# Altium schematic sheet Powering.SchDoc
size A; SheetNumber: 1; SheetTotal: 2
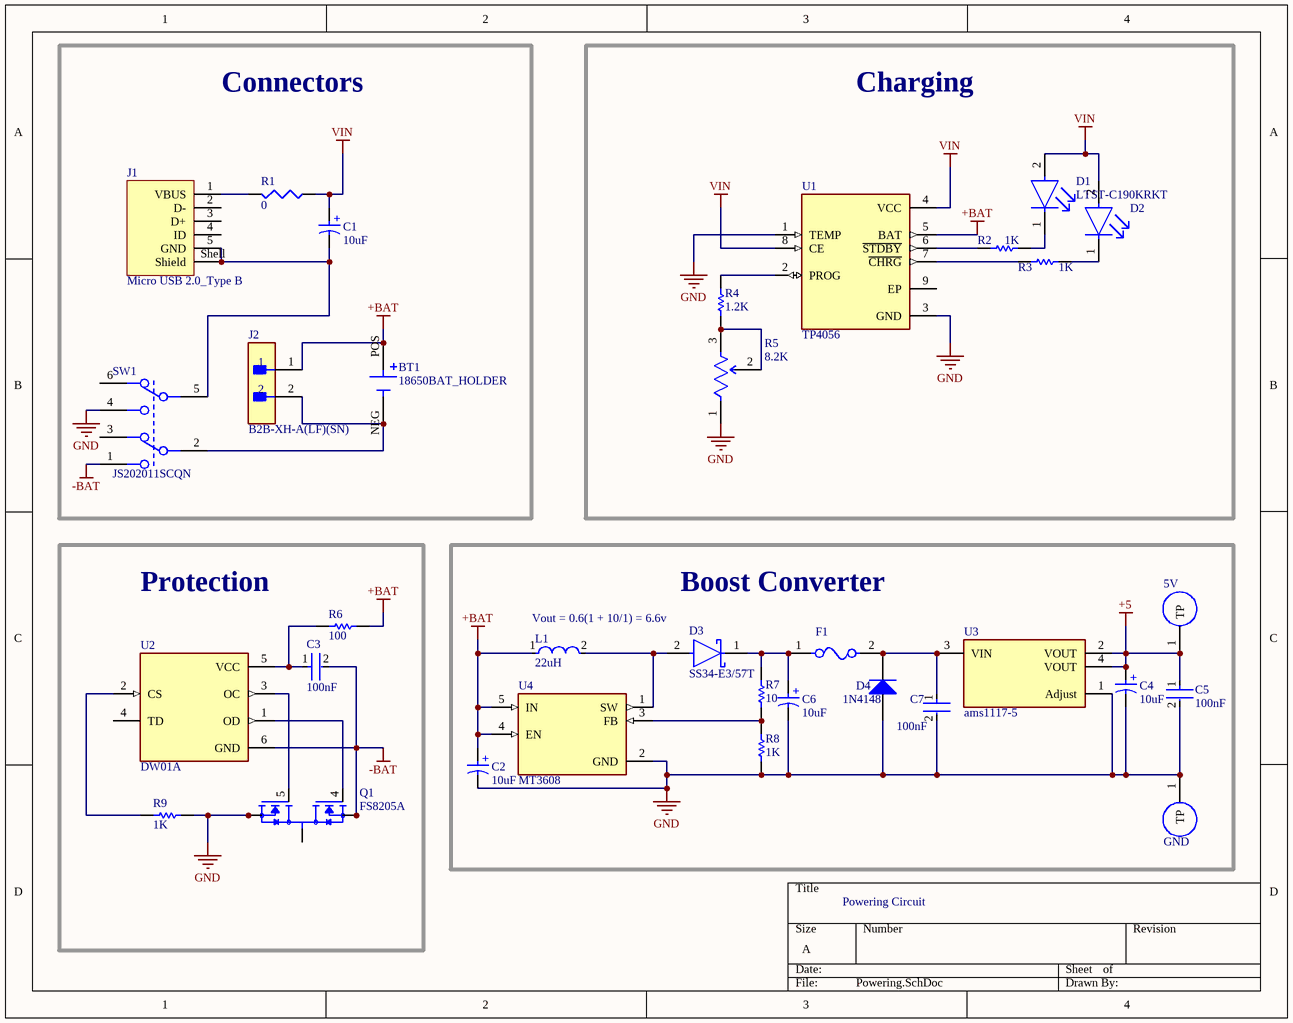
[diagram p0: Powering.SchDoc]

## Parts
5V  Test Point  [Test_Point]  (value not drawn)  (no BOM)
BT1  18650BAT_HOLDER  [18650BAT_HOLDER]
C1  10uF  [WCAP-ASLU_D3H5.5]
C2  10uF  [WCAP-ASLU_D3H5.5]
C3  100nF  [FP-C0402-BB-MFG]
C4  10uF  [WCAP-ASLU_D3H5.5]
C5  100nF  [FP-CGA3E-0_3-0_1-IPC_A]
C6  10uF  [WCAP-ASLU_D3H5.5]
C7  100nF  [FP-CGA3E-0_3-0_1-IPC_A]
D1  LTST-C190KRKT  [FP-LTST-C190KRKT-MFG]
D2  LTST-C190GKT  [FP-LTST-C190GKT-MFG]  (value not drawn)
D3  SS34-E3/57T  [FP-95402-MFG]
D4  1N4148  [DIOD-SOD123-2_V]
F1  0154004.DR  [FP-0154-MFG]  (value not drawn)
GND  Test Point  [Test_Point]  (value not drawn)  (no BOM)
J1  Micro USB 2.0_Type B  [Micro USB 2.0_Type B]
J2  B2B-XH-A(LF)(SN)  [FP-B2B-XH-A_LF_SN-MFG]
L1  22uH  [FP-IHLP-2525CZ-FP_2_413x3-MFG]
Q1  FS8205A  [SOP65P640X120-8N]
R1  value 0  [J1-0603]
R2  1K  [RESC1005X40X25NL05T10]
R3  1K  [RESC1005X40X25NL05T10]
R4  1.2K  [RESC1608X55X25ML10T15]
R5  8.2K  [FP-TS53YL-MFG]
R6  100  [RESC1005X40X25NL05T10]
R7  10  [RESC1608X55X25ML10T15]
R8  1K  [RESC1608X55X25ML10T15]
R9  1K  [RESC1608X55X25ML10T15]
SW1  JS202011SCQN  [FP-JS202011SCQN-MFG]
U1  TP4056  [TP4056]
U2  DW01A  [SOT95P280X145-6N]
U3  ams1117-5  [FP-ams1117-IPC_C]
U4  MT3608  [SOT95P280X145-6N]

## Blocks framed on the sheet
Connectors: BT1 C1 J1 J2 R1 SW1
Charging: D1 D2 R2-R5 U1
Protection: C3 Q1 R6 R9 U2
Boost Converter: 5V C2 C4-C7 D3 D4 F1 GND L1 R7 R8 U3 U4

## Nets
+5: 5V.1(TP) C4.1(P) C5.1 U3.2(VOUT) U3.4(VOUT)
+BAT: BT1.POS C2.1(P) J2.1 L1.1 R6.2 U1.5(BAT) U4.4(EN) U4.5(IN)
-BAT: C3.2 Q1.2(S1) Q1.3(S1) SW1.1 U2.6(GND)
GND: C2.2(N) C4.2(N) C5.2 C6.2(N) C7.2 D4.1(A) GND.1(TP) Q1.6(S2) Q1.7(S2) R5.1(a) R8.1 R9.2 SW1.4 U1.1(TEMP) U1.3(GND) U3.1(Adjust) U4.2(GND)
VIN: C1.1(P) D1.2(A) D2.2(A) R1.1 U1.4(VCC) U1.8(CE)
NetBT1_NEG: BT1.NEG J2.2 SW1.2
NetC1_2: C1.2(N) J1.5(GND) J1.Shell(Shield) SW1.5
NetC3_1: C3.1 R6.1 U2.5(VCC)
NetC6_1: C6.1(P) D3.1(C) F1.1 R7.2
NetC7_1: C7.1 D4.2(K) F1.2 U3.3(VIN)
NetD1_1: D1.1(C) R2.2
NetD2_1: D2.1(C) R3.2
NetD3_2: D3.2(A) L1.2 U4.1(SW)
NetJ1_1: J1.1(VBUS) R1.2
NetQ1_1: Q1.1(D12) Q1.8(D12)
NetQ1_4: Q1.4(G1) U2.1(OD)
NetQ1_5: Q1.5(G2) U2.3(OC)
NetR2_1: R2.1 U1.6(~{STDBY})
NetR3_1: R3.1 U1.7(~{CHRG})
NetR4_1: R4.1 R5.2(b) R5.3(c)
NetR4_2: R4.2 U1.2(PROG)
NetR7_1: R7.1 R8.2 U4.3(FB)
NetR9_1: R9.1 U2.2(CS)

Not connected (* = marked no-connect by the designer): J1 2(D-) 3(D+) 4(ID); SW1 3 6; U1 9(EP); U2 4(TD)

## Notes on the sheet
- Vout = 0.6(1 + 10/1) = 6.6v
- Powering Circuit
- (in symbol WCAP-ASLU_D3H5.5) +

## Library data of the parts
BT1 = 18650BAT_HOLDER: Battery Holder (Open) 18650 1 Cell PC Pin; MP: BK-18650-PC2; Price: None; Value: *; Package: None; Availability: Unavailable
C1 C2 C4 C6 = WCAP-ASLU_D3H5.5: WCAP-ASLU Aluminum Electrolytic Capacitor, V-Chip, D4 x H5.5mm, 10uF, 6.3V; Manufacturer Part Number: 865090140001; Manufacturer: Wurth Elektronik; Capacitance Tolerance: +/-20%; Dissipation Factor: 26%; Endurance: 1000h; Leakage Current: 0.4uA; Ripple Current: 15mA; Technical Reference: ASBB055100M6R3DVCTAA000; Category: Aluminum Electrolytic Capacitors; Match Code: WCAP-ASLU; ComponentLink1Description: Website Link; ComponentLink1URL: https://www.we-online.com/redexpert/article/865090140001?ad; ComponentLink2Description: Datasheet Link; ComponentLink2URL: https://www.we-online.com/redexpert/spec/865090140001?ad; Mount: Surface Mount; Operating Temperature Max: 85°C; Operating Temperature Min: -40°C; Packaging: Tape and Reel; Height: 5.5mm; Diameter: 4mm; Capacitance: 10uF; Rated Voltage (DC): 6.3V
C3 = CMP-2008-02046-2: CAP CER 0.1UF 10V X5R 0402; Manufacturer: Kemet; Manufacturer Part Number: C0402C104K8PACTU; Material: Ceramic; Capacitance: 0.10 μF; Temperature Coefficient: 15%; Tolerance: 0.1; Value: 0.10 μF; Package: C0402-BB; Temperature: -55°C to +125°C; ComponentLink2Description: Datasheet; Temperature Characteristic: X5R; Device Class L1: Passive Components; Height: 0.55mm; Lead Free: Yes; ComponentLink2URL: https://content.kemet.com/datasheets/KEM_C1002_X7R_SMD.pdf; Device Class L2: Capacitors; Temperature Range Low: -55°C; Temperature Range High: +125°C; RoHS: TRUE; Octopart: https://octopart.com/c0402c104k8pactu-kemet-140039; Automotive: No; Mouser Description: Capacitor 100 nF 10 VDC 0402; Category: Cap; Voltage Rating: 10 V; Digikey Description: CAP CER 0.1UF 10V X5R 0402; Ipc Land Pattern Name: CAPC10050X50; Device Class L3: Ceramic Capacitors
C5 C7 = CMP-2000-07546-2: Cap Ceramic 100nF 50V X7R 10% Pad SMD 0603 +125°C Automotive T/R; Weight: 7.1E-05oz; Composition: Ceramic; Max Operating Temperature: 125°C; Termination: SMD/SMT; Dielectric: X7R; Length: 1.6mm; Package Quantity: 1; REACH SVHC: No SVHC; Lead Free: Lead Free; Case Code (Metric): 1608; Min Operating Temperature: -55°C; Packaging: Tape and Reel; Tolerance: 10%; Voltage Rating: 50V; Case Code (Imperial): 0603; Capacitance: 100nF; Case/Package: 0603; Voltage Rating (DC): 50V; Depth: 0.8mm; Radiation Hardening: No; Ratings: AEC-Q200; Mount: Surface Mount; Voltage: 50V; Thickness: 0.035inch; Width: 0.8mm; Height: 0.8mm
D1 = CMP-1674-00011-2: LED RED CLEAR CHIP SMD; Reverse Voltage: 5V; Viewing Angle: 130°; Power Rating: 75mW; Test Current: 20mA; Number of Elements: 1; Lens Color: Colorless; Wavelength: 639nm; Dominant Wavelength: 631nm; Lens Style: Diffused; Forward Current: 30mA; Forward Voltage: 2.4V; Luminous Intensity: 54mcd; Color: Red; Case Code (Imperial): 0603; Lens Transparency: Clear; Lead Free: Lead Free; Package Quantity: 1; Packaging: Tape and Reel; Max Operating Temperature: 85°C; Number of Pins: 2; Height: 0.8mm; Case/Package: 0603; Number of LEDs: 1; Width: 0.8mm; Case Code (Metric): 1608; Depth: 0.8mm; Mount: Surface Mount; Radiation Hardening: No; Length: 1.6mm; Illumination Color: Red; Power Dissipation: 75mW; Min Operating Temperature: -55°C
D2 = CMP-22017-000005-2: LED GREEN CLEAR CHIP SMD; Dominant Wavelength: 569nm; Reverse Voltage: 5V; Lens Color: Colorless; Viewing Angle: 130°; Voltage: 2V; Forward Current: 30mA; Power Dissipation: 100mW; Luminous Intensity: 6mcd; Number of LEDs: 1; Forward Voltage: 2.1V; Wavelength: 565nm; Test Current: 10mA; Min Operating Temperature: -55°C; Lens Style: Clear; Mount: Surface Mount; Width: 0.8mm; Packaging: Tape and Reel; Lens Transparency: Clear; Case Code (Metric): 1608; Depth: 0.8mm; Case Code (Imperial): 0603; Case/Package: 0603; Number of Pins: 2; Max Operating Temperature: 85°C; Lead Free: Lead Free; Number of Elements: 1; Length: 1.6mm; Height: 0.8mm; Package Quantity: 1; Power Rating: 100mW; Radiation Hardening: No; Illumination Color: Green; Color: Green
D3 = CMP-02539-000012-1: DIODE SCHOTTKY 40V 3A DO214AB; Manufacturer: Vishay; Max Junction Temp: +150°C; Peak Reverse Current: 0.5mA; Max Surge Forward Current: 100A; Standoff Height: 0mm; ComponentLink2Description: Datasheet; Device Class L3: Schottky Diodes; Height: 2.62mm; Max Repetitive Reverse Voltage: 40V; Lead Free: Yes; Package: 95402; Temperature Range High: +150°C; ComponentLink2URL: http://www.vishay.com/docs/88751/ss32.pdf; Temperature: -55°C to +150°C; Footprint Url: http://www.vishay.com/docs/95402/smc.pdf; Automotive: No; Forward Current: 3A; Category: Diode; Manufacturer Part Number: SS34-E3/57T; RoHS: TRUE; Device Class L2: Diodes; Mouser Description: Schottky Diodes & Rectifiers 3.0 Amp 40 Volt; Octopart: https://octopart.com/ss34-e3%2F57t-vishay-39552907; Temperature Range Low: -55°C; Device Class L1: Discrete Semiconductors; Digikey Description: DIODE SCHOTTKY 40V 3A DO214AB
D4 = CMP-2000-04932-2: Fast Switching Diode, 100 V, 0.15 A, -65 to 150 degC, 2-Pin?SOD123, RoHS, Tape and Reel; Recovery Time: 4ns; Brand: DiodesIncorporated; Unit Weight: 0.000353oz; Max Surge Current: 2A; Peak Reverse Voltage: 100V; Ir - Reverse Current: 1uA; Vf - Forward Voltage: 1.25V; Configuration: Single; If - Forward Current: 0.15A; Product Category: Diodes-GeneralPurpose,Power,Switching; Operating Temperature Range: -65Cto+150C; Packaging: Reel; Manufacturer URL: http://www.diodes.com/; Maximum Operating Temperature: +150C; Height: 1.25mm; Minimum Operating Temperature: -65C; Product: SwitchingDiodes; Package URL: http://www.diodes.com/datasheets/ds18004.pdf; Type: SwitchingDiode; Package Reference: SOD123-2; Width: 1.7mm; Datasheet URL: http://www.farnell.com/datasheets/1915529.pdf; Datasheet Version: Rev. 24-2, 10/2013; Series: 1N4148; Factory Pack Quantity: 3000; Length: 2.85mm; RoHS: True; Manufacturer: DiodesIncorporated; Mounting Style: SMD/SMT; Package / Case: SOD-123
F1 = CMP-08605-000003-1: FUSE BRD MNT 4A 125VAC/VDC 2SMD; Manufacturer: Littelfuse; Fuse Blow Speed: Fast; Max Fuse Ac Voltage: 125V; Lead Free: Yes; Device Class L3: unset; Manufacturer Part Number: 0154004.DR; Device Class L2: Fuses; Package: 0154; ComponentLink2Description: Datasheet; Temperature Range Low: -55°C; Temperature Range High: +125°C; Device Class L1: Circuit Protection; Height: 3.81mm; Temperature: -55°C to +125°C; Mouser Description: Surface Mount Fuses Fuseblock w/ fuse 4A OMNI BLOK 154; Automotive: No; Digikey Description: FUSE BRD MNT 4A 125VAC/VDC 2SMD; RoHS: TRUE; Category: Fuse; Fuse Current: 4A; Max Fuse Dc Voltage: 125V; ComponentLink2URL: https://www.littelfuse.com/~/media/electronics/datasheets/fuses/littelfuse_fuse_154_154t_154l_154tl_datasheet.pdf.pdf; Octopart: https://octopart.com/0154004.dr-littelfuse-565861
J1 = Micro USB 2.0_Type B: NexarPartId: 52645113; Number of Contacts: 5; Contact Resistance: 30mΩ; Voltage Rating: 30V; Current Rating: 3A; USB Standard: USB 2.0; Gender: Receptacle; Insulation Resistance: 1GΩ; Height: 2.86mm; REACH SVHC: Unknown; Connector Type: USB; RoHS: Compliant; Features: Shielded; Termination: SMD/SMT; Number of Pins: 5; Contact Plating: Gold; Packaging: Tape and Reel; Contact Material: Gold; Mount: Horizontal, Surface Mount; Max Operating Temperature: 85°C; Lead Free: Lead Free; Min Operating Temperature: -40°C; Orientation: Horizontal; Operating Supply Voltage: 30V
J2 = CMP-2000-05888-3: CONN HEADER VERT 2POS 2.5MM; Current Rating: 3A; Voltage Rating: 250V; Number of Contacts: 2; Contact Resistance: 20mR; Wire/Cable Gauge: 22AWG; Insulation Resistance: 1GR; Connector Type: Male Pin; Packaging: Bulk; Contact Material: Brass; Lead Free: Lead Free; Orientation: Straight; Contact Plating: Tin; Max Current Rating: 3A; Termination: Solder; Fastening Type: Detent; Depth: 5.75mm; Housing Material: Polyamide; REACH SVHC: No SVHC; Series: XH; Voltage Rating (AC): 250V; Number of Positions: 2; Color: Natural; Contact Type: Male Pin; Max Voltage Rating (DC): 250V; Pitch: 2.5mm; Lead Pitch: 2.5mm; Mount: Through Hole; Max Operating Temperature: 85°C; Length: 7.4mm; Max Voltage Rating (AC): 250V; Min Operating Temperature: -25°C; Number of Rows: 1; Housing Color: White
L1 = CMP-2000-06442-2: Commercial Inductors, Low DCR Series 22uH 2.9A 135mΩ 20%; Self Resonant Frequency: 1MHz; Shielding: Shielded; Core Material: Ferrite; DC Resistance (DCR): 135mR; Test Frequency: 100kHz; Saturation Current: 2.5A; Case/Package: 2525; Inductance Tolerance: 20%; Max DC Current: 2.9A; Inductance: 22uH; Termination: SMD/SMT; Case Code (Imperial): 2525; Mount: Surface Mount; Military Standard: Not; Min Operating Temperature: -55°C; RMS Current (Irms): 2.9A; Package Quantity: 2000; Max Operating Temperature: 125°C; Length: 7.24mm; Depth: 6.72mm; Packaging: Tape and Reel; Height: 3mm; Width: 0.255inch; Lead Free: Lead Free; Tolerance: 20%; Contact Plating: Tin; Current Rating: 2.9A; Number of Pins: 2; Case Code (Metric): 6363; Radiation Hardening: No; Height - Seated (Max): 0.118inch
Q1 = FS8205A: N/A; MF: Fortune Semiconductor; MP: FS8205A; Value: *; Availability: Not in stock; Package: Package; Price: None; SnapEDA_Link: https://www.snapeda.com/parts/FS8205A/Fortune+Semiconductor/view-part/?ref=snap; Check_prices: https://www.snapeda.com/parts/FS8205A/Fortune+Semiconductor/view-part/?ref=eda
R1 = Res3: Resistor; Published: 8-Jun-2000; LatestRevisionDate: 29-May-2009; LatestRevisionNote: IPC-7351 Footprint Added.; PackageReference: J1-0603; Publisher: Altium Limited; PackageDescription: Chip Resistor
R2 R3 R6 = CMP-1011-00001-2: Manufacturer: Yageo / Phycomp; Part Number: RC0402JR-070RL
R4 R9 = CMP-2100-03667-1: Chip Resistor, 0 Ohm, +/- 5%, 0.1 W, -55 to 155 degC, 0603 (1608 Metric), RoHS, Tape and Reel; Manufacturer: Yageo; Temperature Coefficient: 200ppm/degreesC; Voltage Rating: 50V; Power Rating: 100mW; Resistance: 0mOhm; Width: 0.8mm; Max Operating Temperature: 155degC; Tolerance: 5%; Package Reference: 0603; Height: 0.45mm; Depth: 0.8mm; Package Description: 2-Pin Surface Mount Device, Body 1.6 x 0.8 mm; Termination: SMD/SMT; Package Quantity: 5000; Case/Package: 0603; Case Code (Imperial): 0603; Radiation Hardening: No; Number of Pins: 2; Length: 1.6mm; Lead Free: LeadFree; Voltage Rating (DC): 50V; Military Standard: Not; Datasheet URL: http://www.yageo.com/NewPortal/yageodocoutput?fileName=/pdf/R-Chip/PYu-RC_Group_51_RoHS_L_5.pdf; Manufacturer URL: http://www.yageo.com/; Packaging: TapeandReel; Case Code (Metric): 1608; Min Operating Temperature: -55degC; Composition: ThickFilm; RoHSCompliant: true; Contact Plating: Tin; Datasheet Version: Rev. 5, 10/2016; REACH SVHC: NoSVHC
R5 = CMP-02410-000004-1: TRIMMER 10K OHM 0.25W GW TOP ADJ; Power Rating: 250mW; Number of Turns: 1; Resistance Tolerance: 20%; Resistance: 10kR; Temperature Coefficient: 100ppm/°C; Mount: Surface Mount; Max Operating Temperature: 125°C; Military Standard: Not; Min Operating Temperature: -55°C; Series: TS53Y; Lead Free: Lead Free; Resistor Type: Cermet; Length: 5mm; Termination: Gull Wing; RoHS Compliant: Yes; Tolerance: 20%; Taper: Linear; Height: 2.7mm; Package Quantity: 1; Width: 5mm; Depth: 6.4mm; Technology: CERMET; Packaging: Tape and Reel; Max Power Dissipation: 250mW; Radiation Hardening: No
R7 = CMP-2100-03667-1: Chip Resistor, 0 Ohm, +/- 5%, 0.1 W, -55 to 155 degC, 0603 (1608 Metric), RoHS, Tape and Reel; Manufacturer: Yageo; Temperature Coefficient: 200ppm/degreesC; Voltage Rating: 50V; Power Rating: 100mW; Resistance: 7.5K; Width: 0.8mm; Max Operating Temperature: 155degC; Tolerance: 5%; Package Reference: 0603; Height: 0.45mm; Depth: 0.8mm; Package Description: 2-Pin Surface Mount Device, Body 1.6 x 0.8 mm; Termination: SMD/SMT; Package Quantity: 5000; Case/Package: 0603; Case Code (Imperial): 0603; Radiation Hardening: No; Number of Pins: 2; Length: 1.6mm; Lead Free: LeadFree; Voltage Rating (DC): 50V; Military Standard: Not; Datasheet URL: http://www.yageo.com/NewPortal/yageodocoutput?fileName=/pdf/R-Chip/PYu-RC_Group_51_RoHS_L_5.pdf; Manufacturer URL: http://www.yageo.com/; Packaging: TapeandReel; Case Code (Metric): 1608; Min Operating Temperature: -55degC; Composition: ThickFilm; RoHSCompliant: true; Contact Plating: Tin; Datasheet Version: Rev. 5, 10/2016; REACH SVHC: NoSVHC
R8 = CMP-2100-03667-1: Chip Resistor, 0 Ohm, +/- 5%, 0.1 W, -55 to 155 degC, 0603 (1608 Metric), RoHS, Tape and Reel; Manufacturer: Yageo; Temperature Coefficient: 200ppm/degreesC; Voltage Rating: 50V; Power Rating: 100mW; Width: 0.8mm; Max Operating Temperature: 155degC; Tolerance: 5%; Package Reference: 0603; Height: 0.45mm; Depth: 0.8mm; Package Description: 2-Pin Surface Mount Device, Body 1.6 x 0.8 mm; Termination: SMD/SMT; Package Quantity: 5000; Case/Package: 0603; Case Code (Imperial): 0603; Radiation Hardening: No; Number of Pins: 2; Length: 1.6mm; Lead Free: LeadFree; Voltage Rating (DC): 50V; Military Standard: Not; Datasheet URL: http://www.yageo.com/NewPortal/yageodocoutput?fileName=/pdf/R-Chip/PYu-RC_Group_51_RoHS_L_5.pdf; Resistance: 1K; Manufacturer URL: http://www.yageo.com/; Packaging: TapeandReel; Case Code (Metric): 1608; Min Operating Temperature: -55degC; Composition: ThickFilm; RoHSCompliant: true; Contact Plating: Tin; Datasheet Version: Rev. 5, 10/2016; REACH SVHC: NoSVHC
SW1 = CMP-2000-05087-3: SWITCH SLIDE DPDT 300MA 6V; Switch Function: On-On; Actuator Type: Standard; Switch Travel: 2mm; Actuator Color: Black; Contact Resistance: 70mR; Electrical Life: 5000Cycles; Actuator Material: Nylon; REACH SVHC: No SVHC; Series: JS; Min Operating Temperature: -20°C; Depth: 7.5mm; Housing Material: Nylon; Voltage Rating (DC): 6V; Max Operating Temperature: 85°C; Contact Current Rating: 300mA; Package Quantity: 1; Contact Plating: Silver; Contact Material: Copper Alloy; Throw Configuration: DPDT; Current Rating: 300mA; Orientation: Vertical; Max Current Rating: 300mA; Max Voltage Rating (DC): 6V; Flammability Rating: UL94 V-2; Length: 9mm; Packaging: Tape and Reel; Mount: Surface Mount; Actuator Length: 2mm; Lead Free: Lead Free; Termination: Gull Wing; Radiation Hardening: No
U1 = TP4056: Complete single cell Li-Ion battery with a constant current / constant voltage linear charger; MF: NanJing Top Power ASIC Corp.; Check_prices: https://www.snapeda.com/parts/TP4056/NanJing+Top+Power+ASIC+Corp./view-part/?ref=eda; SnapEDA_Link: https://www.snapeda.com/parts/TP4056/NanJing+Top+Power+ASIC+Corp./view-part/?ref=snap; Price: None; Availability: Not in stock; Package: Package; MP: TP4056; Value: *
U2 = DW01A: One Cell Lithium-ion/Polymer Battery Protection IC; MF: Fortune Semiconductor; SnapEDA_Link: https://www.snapeda.com/parts/DW01A/Fortune+Semiconductor/view-part/?ref=snap; Package: SOT-23-6 Fortune Semiconductor; Value: *; MP: DW01A; Check_prices: https://www.snapeda.com/parts/DW01A/Fortune+Semiconductor/view-part/?ref=eda
U3 = CMP-209535-000002-1: 1A LOW DROPOUT VOLTAGE REGULATOR; RoHS Compliant: Yes
U4 = MT3608: High Efficiency 1.2MHz2A Step Up Converter; MF: Aerosemi Technology Co., Ltd; Price: None; Availability: Not in stock; Package: Package; MP: MT3608; Value: *; SnapEDA_Link: https://www.snapeda.com/parts/MT3608/Aerosemi+Technology+Co.%252C+Ltd/view-part/?ref=snap; Check_prices: https://www.snapeda.com/parts/MT3608/Aerosemi+Technology+Co.%252C+Ltd/view-part/?ref=eda